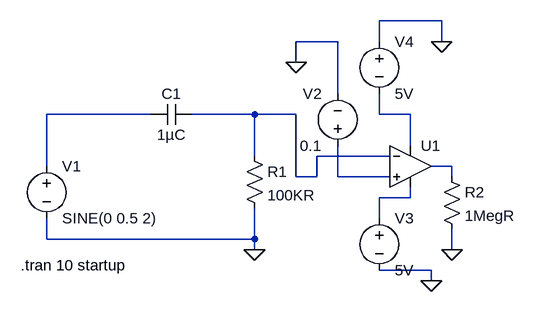
[diagram p0: schematic Step_counter.asc]
Step_counter.asc, the LTspice schematic file:
Version 4.1
SHEET 1 880 680
WIRE 688 -176 592 -176
WIRE 528 -144 464 -144
WIRE 592 -144 592 -176
WIRE 688 -144 688 -176
WIRE 464 -112 464 -144
WIRE 528 -64 528 -144
WIRE 240 -32 80 -32
WIRE 400 -32 304 -32
WIRE 464 -32 400 -32
WIRE 592 -32 592 -64
WIRE 640 -32 592 -32
WIRE 640 16 640 -32
WIRE 400 32 400 -32
WIRE 608 32 496 32
WIRE 80 48 80 -32
WIRE 704 48 672 48
WIRE 464 64 464 -32
WIRE 496 64 496 32
WIRE 496 64 464 64
WIRE 528 64 528 16
WIRE 608 64 528 64
WIRE 704 64 704 48
WIRE 640 96 640 80
WIRE 640 96 592 96
WIRE 592 128 592 96
WIRE 80 160 80 128
WIRE 400 160 400 112
WIRE 400 160 80 160
WIRE 400 176 400 160
WIRE 704 176 704 144
WIRE 672 208 592 208
WIRE 672 224 672 208
FLAG 400 176 0
FLAG 464 -112 0
FLAG 688 -144 0
FLAG 672 224 0
FLAG 704 176 0
SYMBOL voltage 80 32 R0
WINDOW 123 0 0 Left 0
WINDOW 39 0 0 Left 0
SYMATTR InstName V1
SYMATTR Value SINE(0 0.5 2)
SYMBOL cap 304 -48 R90
WINDOW 0 0 32 VBottom 2
WINDOW 3 32 32 VTop 2
SYMATTR InstName C1
SYMATTR Value 1µC
SYMBOL res 384 16 R0
SYMATTR InstName R1
SYMATTR Value 100KR
SYMBOL voltage 528 32 R180
WINDOW 0 24 96 Left 2
WINDOW 3 24 16 Left 2
WINDOW 123 0 0 Left 0
WINDOW 39 0 0 Left 0
SYMATTR InstName V2
SYMATTR Value 0.1
SYMBOL voltage 592 112 R0
WINDOW 123 0 0 Left 0
WINDOW 39 0 0 Left 0
SYMATTR InstName V3
SYMATTR Value 5V
SYMBOL voltage 592 -160 R0
WINDOW 123 0 0 Left 0
WINDOW 39 0 0 Left 0
SYMATTR InstName V4
SYMATTR Value 5V
SYMBOL res 688 48 R0
SYMATTR InstName R2
SYMATTR Value 1MegR
SYMBOL OpAmps\\UniversalOpAmp2 640 48 R0
SYMATTR InstName U1
TEXT 40 200 Left 2 !.tran 10 startup

The netlist it stands for:
* Step_counter.asc
V1 N001 0 SINE(0 0.5 2)
C1 N002 N001 1µC
R1 N002 0 100KR
V2 N005 0 0.1
V3 N006 0 5V
V4 0 N003 5V
R2 N004 0 1MegR
X§U1 N005 N002 N003 N006 N004 level2 Avol=1Meg GBW=10Meg Slew=10Meg Ilimit=25m Rail=0 Vos=0 En=0 Enk=0 In=0 Ink=0 Rin=500Meg  ; pins In+ In- V+ V- OUT
.tran 10 startup
.lib UniversalOpAmp2.lib
.backanno
.end